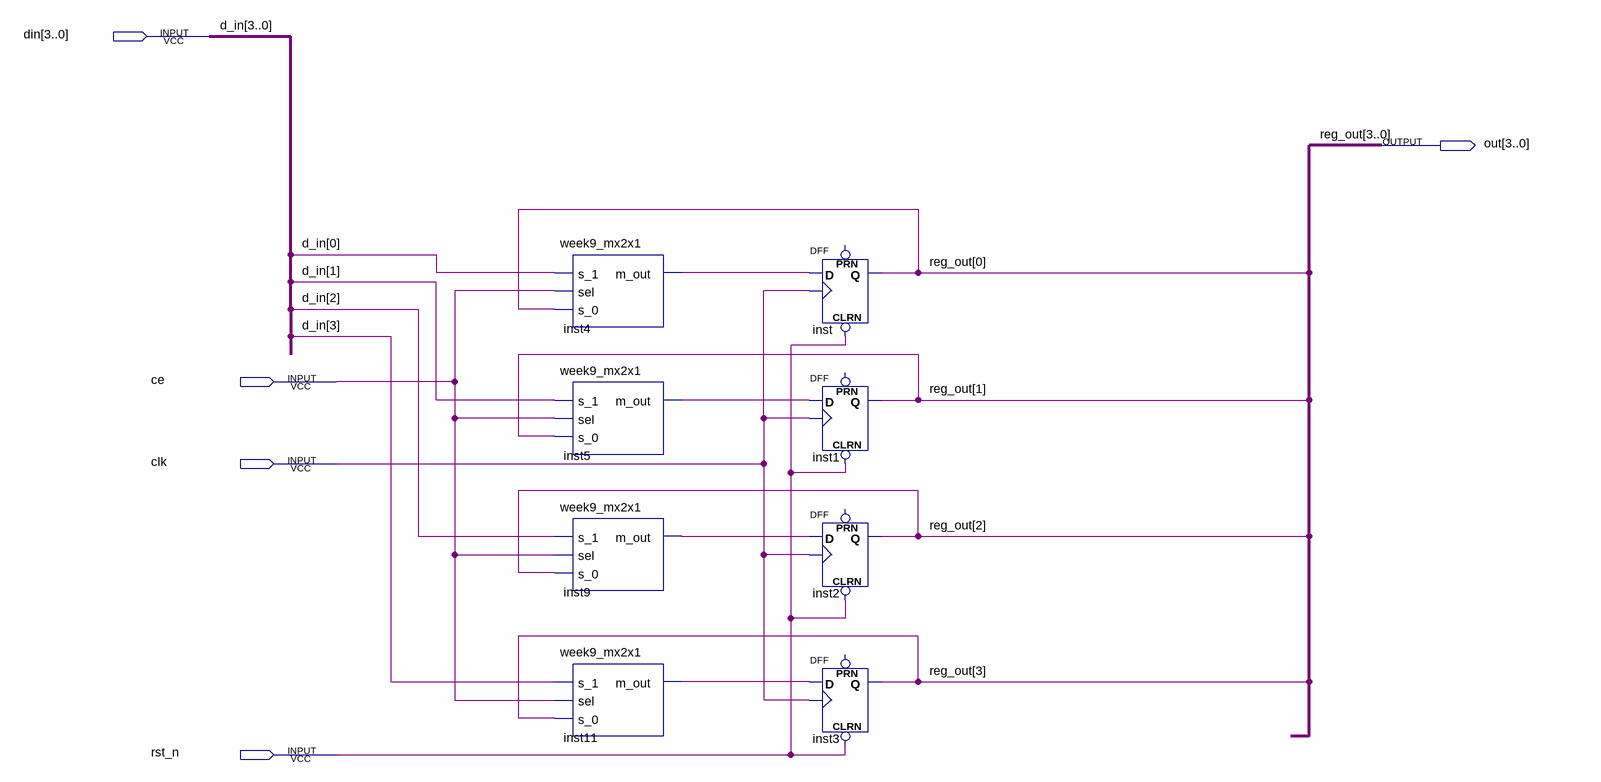
[diagram p0: schematic sheet]
// Quartus schematic week10_4BitRegCE.bdf as structural Verilog: 8 symbols, 5 pins
module week10_4BitRegCE (
  input  [3:0] din,
  input  ce,
  input  clk,
  input  rst_n,
  output [3:0] out
);

  wire inst4_m_out, inst5_m_out, inst9_m_out, inst11_m_out;

  week9_mx2x1 inst4 (.s_1(din[0]), .sel(ce), .s_0(out[0]), .m_out(inst4_m_out));
  week9_mx2x1 inst5 (.s_1(din[1]), .sel(ce), .s_0(out[1]), .m_out(inst5_m_out));
  week9_mx2x1 inst9 (.s_1(din[2]), .sel(ce), .s_0(out[2]), .m_out(inst9_m_out));
  week9_mx2x1 inst11 (.s_1(din[3]), .sel(ce), .s_0(out[3]), .m_out(inst11_m_out));
  DFF inst (.CLRN(rst_n), .CLK(clk), .D(inst4_m_out), .Q(out[0]));  // open: PRN
  DFF inst1 (.CLRN(rst_n), .CLK(clk), .D(inst5_m_out), .Q(out[1]));  // open: PRN
  DFF inst2 (.CLRN(rst_n), .CLK(clk), .D(inst9_m_out), .Q(out[2]));  // open: PRN
  DFF inst3 (.CLRN(rst_n), .CLK(clk), .D(inst11_m_out), .Q(out[3]));  // open: PRN

  // Other names for the same wires on the sheet: d_in[3:0] = din; reg_out[3:0] = out
endmodule
